# Altium schematic sheet Sheet2.SchDoc
size A4; SheetNumber: 1; SheetTotal: 7
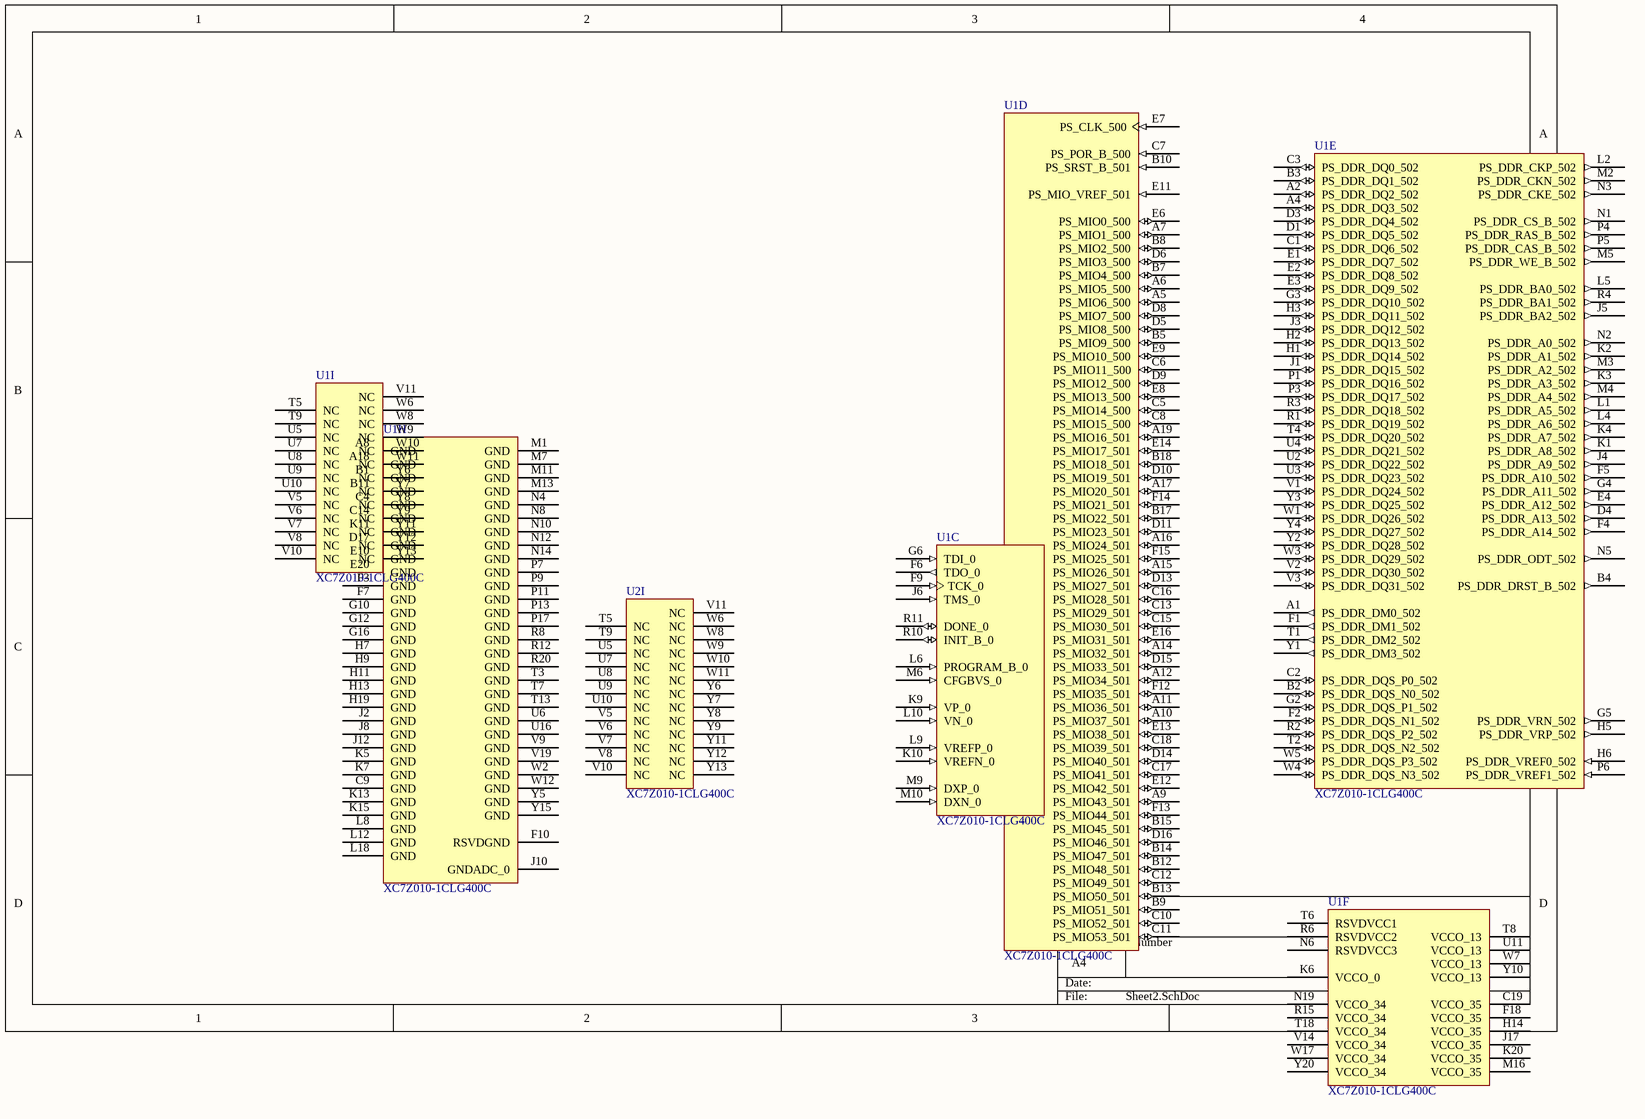
[diagram p0: Sheet2.SchDoc]

## Parts
U1  XC7Z010-1CLG400C  [CLG400]  (parts C,D,E,F,H,I of 9)
U2  XC7Z010-1CLG400C  [CLG400]  (part I of 9)

## Nets

Not connected (* = marked no-connect by the designer): U1 A1(PS_DDR_DM0_502) A2(PS_DDR_DQ2_502) A4(PS_DDR_DQ3_502) A5(PS_MIO6_500) A6(PS_MIO5_500) A7(PS_MIO1_500) A8(GND) A9(PS_MIO43_501) A10(PS_MIO37_501) A11(PS_MIO36_501) A12(PS_MIO34_501) A14(PS_MIO32_501) A15(PS_MIO26_501) A16(PS_MIO24_501) A17(PS_MIO20_501) A18(GND) A19(PS_MIO16_501) B1(GND) B2(PS_DDR_DQS_N0_502) B3(PS_DDR_DQ1_502) B4(PS_DDR_DRST_B_502) B5(PS_MIO9_500) B7(PS_MIO4_500) B8(PS_MIO2_500) B9(PS_MIO51_501) B10(PS_SRST_B_501) B11(GND) B12(PS_MIO48_501) B13(PS_MIO50_501) B14(PS_MIO47_501) B15(PS_MIO45_501) B17(PS_MIO22_501) B18(PS_MIO18_501) C1(PS_DDR_DQ6_502) C2(PS_DDR_DQS_P0_502) C3(PS_DDR_DQ0_502) C4(GND) C5(PS_MIO14_500) C6(PS_MIO11_500) C7(PS_POR_B_500) C8(PS_MIO15_500) C9(GND) C10(PS_MIO52_501) C11(PS_MIO53_501) C12(PS_MIO49_501) C13(PS_MIO29_501) C14(GND) C15(PS_MIO30_501) C16(PS_MIO28_501) C17(PS_MIO41_501) C18(PS_MIO39_501) C19(VCCO_35) D1(PS_DDR_DQ5_502) D3(PS_DDR_DQ4_502) D4(PS_DDR_A13_502) D5(PS_MIO8_500) D6(PS_MIO3_500) D8(PS_MIO7_500) D9(PS_MIO12_500) D10(PS_MIO19_501) D11(PS_MIO23_501) D13(PS_MIO27_501) D14(PS_MIO40_501) D15(PS_MIO33_501) D16(PS_MIO46_501) D17(GND) E1(PS_DDR_DQ7_502) E2(PS_DDR_DQ8_502) E3(PS_DDR_DQ9_502) E4(PS_DDR_A12_502) E6(PS_MIO0_500) E7(PS_CLK_500) E8(PS_MIO13_500) E9(PS_MIO10_500) E10(GND) E11(PS_MIO_VREF_501) E12(PS_MIO42_501) E13(PS_MIO38_501) E14(PS_MIO17_501) E16(PS_MIO31_501) E20(GND) F1(PS_DDR_DM1_502) F2(PS_DDR_DQS_N1_502) F3(GND) F4(PS_DDR_A14_502) F5(PS_DDR_A10_502) F6(TDO_0) F7(GND) F9(TCK_0) F10(RSVDGND) F12(PS_MIO35_501) F13(PS_MIO44_501) F14(PS_MIO21_501) F15(PS_MIO25_501) F18(VCCO_35) G2(PS_DDR_DQS_P1_502) G3(PS_DDR_DQ10_502) G4(PS_DDR_A11_502) G5(PS_DDR_VRN_502) G6(TDI_0) G10(GND) G12(GND) G16(GND) H1(PS_DDR_DQ14_502) H2(PS_DDR_DQ13_502) H3(PS_DDR_DQ11_502) H5(PS_DDR_VRP_502) H6(PS_DDR_VREF0_502) H7(GND) H9(GND) H11(GND) H13(GND) H14(VCCO_35) H19(GND) J1(PS_DDR_DQ15_502) J2(GND) J3(PS_DDR_DQ12_502) J4(PS_DDR_A9_502) J5(PS_DDR_BA2_502) J6(TMS_0) J8(GND) J10(GNDADC_0) J12(GND) J17(VCCO_35) K1(PS_DDR_A8_502) K2(PS_DDR_A1_502) K3(PS_DDR_A3_502) K4(PS_DDR_A7_502) K5(GND) K6(VCCO_0) K7(GND) K9(VP_0) K10(VREFN_0) K11(GND) K13(GND) K15(GND) K20(VCCO_35) L1(PS_DDR_A5_502) L2(PS_DDR_CKP_502) L4(PS_DDR_A6_502) L5(PS_DDR_BA0_502) L6(PROGRAM_B_0) L8(GND) L9(VREFP_0) L10(VN_0) L12(GND) L18(GND) M1(GND) M2(PS_DDR_CKN_502) M3(PS_DDR_A2_502) M4(PS_DDR_A4_502) M5(PS_DDR_WE_B_502) M6(CFGBVS_0) M7(GND) M9(DXP_0) M10(DXN_0) M11(GND) M13(GND) M16(VCCO_35) N1(PS_DDR_CS_B_502) N2(PS_DDR_A0_502) N3(PS_DDR_CKE_502) N4(GND) N5(PS_DDR_ODT_502) N6(RSVDVCC3) N8(GND) N10(GND) N12(GND) N14(GND) N19(VCCO_34) P1(PS_DDR_DQ16_502) P3(PS_DDR_DQ17_502) P4(PS_DDR_RAS_B_502) P5(PS_DDR_CAS_B_502) P6(PS_DDR_VREF1_502) P7(GND) P9(GND) P11(GND) P13(GND) P17(GND) R1(PS_DDR_DQ19_502) R2(PS_DDR_DQS_P2_502) R3(PS_DDR_DQ18_502) R4(PS_DDR_BA1_502) R6(RSVDVCC2) R8(GND) R10(INIT_B_0) R11(DONE_0) R12(GND) R15(VCCO_34) R20(GND) T1(PS_DDR_DM2_502) T2(PS_DDR_DQS_N2_502) T3(GND) T4(PS_DDR_DQ20_502) T5(NC) T6(RSVDVCC1) T7(GND) T8(VCCO_13) T9(NC) T13(GND) T18(VCCO_34) U2(PS_DDR_DQ22_502) U3(PS_DDR_DQ23_502) U4(PS_DDR_DQ21_502) U5(NC) U6(GND) U7(NC) U8(NC) U9(NC) U10(NC) U11(VCCO_13) U16(GND) V1(PS_DDR_DQ24_502) V2(PS_DDR_DQ30_502) V3(PS_DDR_DQ31_502) V5(NC) V6(NC) V7(NC) V8(NC) V9(GND) V10(NC) V11(NC) V14(VCCO_34) V19(GND) W1(PS_DDR_DQ26_502) W2(GND) W3(PS_DDR_DQ29_502) W4(PS_DDR_DQS_N3_502) W5(PS_DDR_DQS_P3_502) W6(NC) W7(VCCO_13) W8(NC) W9(NC) W10(NC) W11(NC) W12(GND) W17(VCCO_34) Y1(PS_DDR_DM3_502) Y2(PS_DDR_DQ28_502) Y3(PS_DDR_DQ25_502) Y4(PS_DDR_DQ27_502) Y5(GND) Y6(NC) Y7(NC) Y8(NC) Y9(NC) Y10(VCCO_13) Y11(NC) Y12(NC) Y13(NC) Y15(GND) Y20(VCCO_34); U2 T5(NC) T9(NC) U5(NC) U7(NC) U8(NC) U9(NC) U10(NC) V5(NC) V6(NC) V7(NC) V8(NC) V10(NC) V11(NC) W6(NC) W8(NC) W9(NC) W10(NC) W11(NC) Y6(NC) Y7(NC) Y8(NC) Y9(NC) Y11(NC) Y12(NC) Y13(NC)

## Library data of the parts
U1 U2 = CMP-0363-00007-3: 667 MHz Zynq™-7000 AP SoC, 130 PS I/O, 100 FPGA I/O, 400-Ball BGA, Speed Grade 1, Commercial Grade, Pb-Free; Flip Flops: 35200; Speed Grade: -1; LUTs: 17600; Extensible Block RAM (# 36Kb Blocks): 240 KB (60); ComponentLink6Description: PCB and Layout Guide; ComponentLink3Description: DC and AC Switching Characteristics; ComponentLink2URL: http://www.xilinx.com/support/documentation/user_guides/ug865-Zynq-7000-Pkg-Pinout.pdf; PackageReference: CLG400; ComponentLink3URL: http://www.xilinx.com/support/documentation/data_sheets/ds187-XC7Z010-XC7Z020-Data-Sheet.pdf; DatasheetVersion: v1.2; Generic Part Number: XC7Z010; ComponentLink2Description: Package Specification; ComponentLink1Description: Datasheet; PartNumber: XC7Z010-1CLG400C; ComponentLink5Description: Packaging and Pinout; Code_JEDEC: MO-275-MMAA-1; RoHS: Pb-Free; ComponentLink5URL: http://www.xilinx.com/support/documentation/user_guides/ug865-Zynq-7000-Pkg-Pinout.pdf; ComponentLink1URL: http://www.xilinx.com/support/documentation/data_sheets/ds190-Zynq-7000-Overview.pdf; ComponentLink4Description: Package File; ComponentLink4URL: http://www.xilinx.com/support/packagefiles/z7packages/xc7z010clg400pkg.txt; PackageDescription: Wire-Bond Chip-Scale BGA, Body 17 x 17 mm, 0.8 mm Pitch; PackageVersion: Rev 1.1, 09/2012; Mounting Technology: Surface Mount; ComponentLink6URL: http://www.xilinx.com/support/documentation/user_guides/ug483_7Series_PCB.pdf